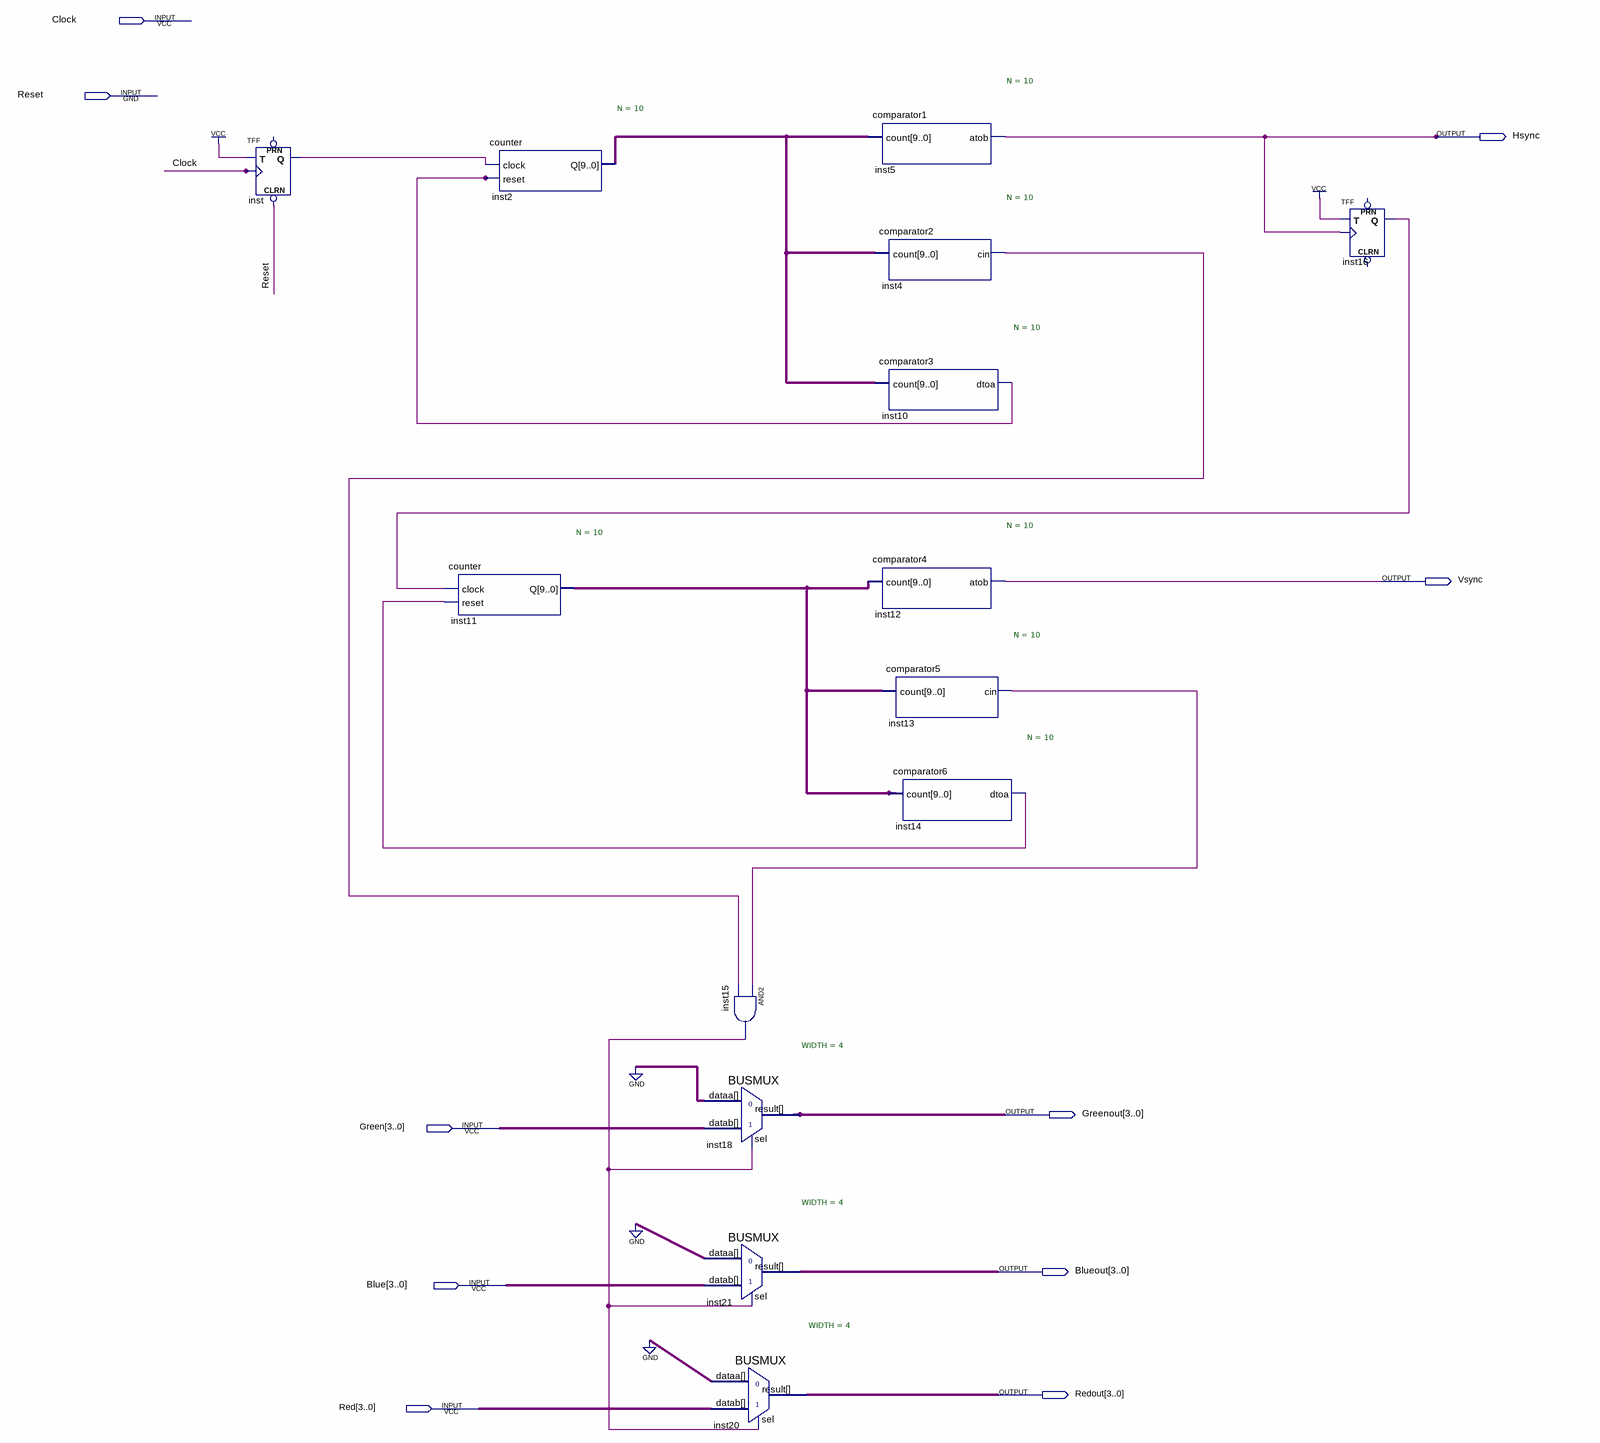
[diagram p0: schematic sheet]
// Quartus schematic Lab_6.bdf as structural Verilog: 14 symbols, 10 pins
module Lab_6 (
  input  Clock,
  input  Reset,
  input  [3:0] Green,
  input  [3:0] Blue,
  input  [3:0] Red,
  output Hsync,
  output Vsync,
  output [3:0] Greenout,
  output [3:0] Blueout,
  output [3:0] Redout
);

  wire inst4_cin, inst10_dtoa, inst13_cin, inst14_dtoa, inst15_out, inst16_q, inst_q;
  wire [9:0] inst2_q, inst11_q;

  TFF inst (.CLRN(Reset), .T(1'b1), .CLK(Clock), .Q(inst_q));  // open: PRN
  counter #(.N(10)) inst2 (.clock(inst_q), .reset(inst10_dtoa), .Q(inst2_q));
  counter #(.N(10)) inst11 (.clock(inst16_q), .reset(inst14_dtoa), .Q(inst11_q));
  BUSMUX #(.WIDTH(4)) inst18 (.datab(Green), .sel(inst15_out), .dataa(4'b0000), .result(Greenout));
  BUSMUX #(.WIDTH(4)) inst21 (.datab(Blue), .sel(inst15_out), .dataa(4'b0000), .result(Blueout));
  and inst15 (inst15_out, inst13_cin, inst4_cin);
  BUSMUX #(.WIDTH(4)) inst20 (.datab(Red), .sel(inst15_out), .dataa(4'b0000), .result(Redout));
  comparator1 #(.N(10)) inst5 (.count(inst2_q), .atob(Hsync));
  comparator4 #(.N(10)) inst12 (.count(inst11_q), .atob(Vsync));
  comparator2 #(.N(10)) inst4 (.count(inst2_q), .cin(inst4_cin));
  comparator3 #(.N(10)) inst10 (.count(inst2_q), .dtoa(inst10_dtoa));
  comparator5 #(.N(10)) inst13 (.count(inst11_q), .cin(inst13_cin));
  comparator6 #(.N(10)) inst14 (.count(inst11_q), .dtoa(inst14_dtoa));
  TFF inst16 (.T(1'b1), .CLK(Hsync), .Q(inst16_q));  // open: PRN, CLRN
endmodule
